# EAGLE schematic BREAKER BOARD FOR TLC5951 (EAGLE 7.7.0)
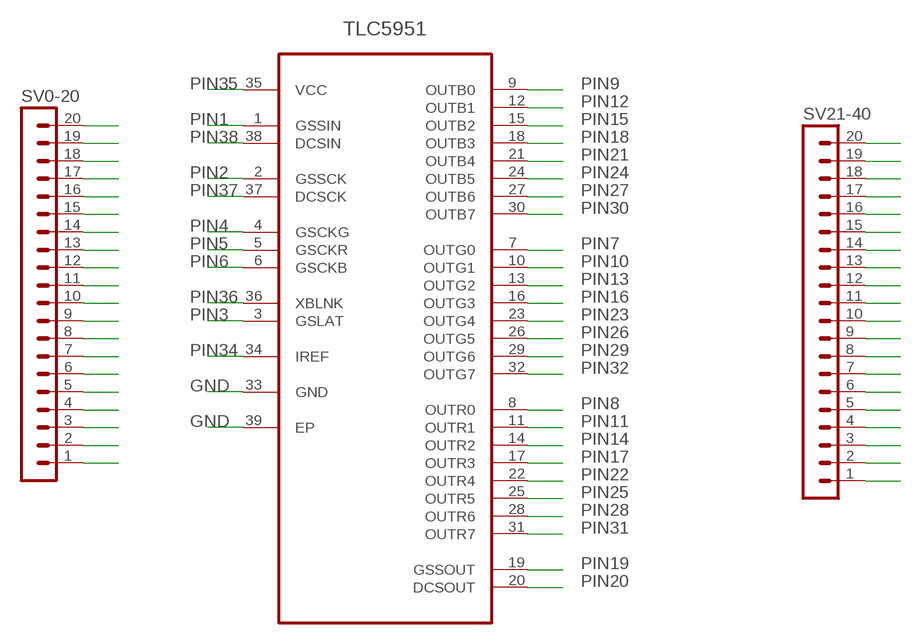
[diagram p0: schematic, sheet 1]

## Parts
SV0-20  MA20-1  [MA20-1]
SV21-40  MA20-1  [MA20-1]
TLC5951  TLC5951DAP  [SOP65P810X120-39N]

## Nets
GND: SV0-20.20 TLC5951.33(GND) TLC5951.39(EP)
PIN1: SV0-20.1 TLC5951.1(GSSIN)
PIN2: SV0-20.2 TLC5951.2(GSSCK)
PIN3: SV0-20.3 TLC5951.3(GSLAT)
PIN4: SV0-20.4 TLC5951.4(GSCKG)
PIN5: SV0-20.5 TLC5951.5(GSCKR)
PIN6: SV0-20.6 TLC5951.6(GSCKB)
PIN7: SV0-20.7 TLC5951.7(OUTG0)
PIN8: SV0-20.8 TLC5951.8(OUTR0)
PIN9: SV0-20.9 TLC5951.9(OUTB0)
PIN10: SV0-20.10 TLC5951.10(OUTG1)
PIN11: SV0-20.11 TLC5951.11(OUTR1)
PIN12: SV0-20.12 TLC5951.12(OUTB1)
PIN13: SV0-20.13 TLC5951.13(OUTG2)
PIN14: SV0-20.14 TLC5951.14(OUTR2)
PIN15: SV0-20.15 TLC5951.15(OUTB2)
PIN16: SV0-20.16 TLC5951.16(OUTG3)
PIN17: SV0-20.17 TLC5951.17(OUTR3)
PIN18: SV0-20.18 TLC5951.18(OUTB3)
PIN19: SV0-20.19 TLC5951.19(GSSOUT)
PIN20: SV21-40.19 TLC5951.20(DCSOUT)
PIN21: SV21-40.18 TLC5951.21(OUTB4)
PIN22: SV21-40.17 TLC5951.22(OUTR4)
PIN23: SV21-40.16 TLC5951.23(OUTG4)
PIN24: SV21-40.15 TLC5951.24(OUTB5)
PIN25: SV21-40.14 TLC5951.25(OUTR5)
PIN26: SV21-40.13 TLC5951.26(OUTG5)
PIN27: SV21-40.12 TLC5951.27(OUTB6)
PIN28: SV21-40.11 TLC5951.28(OUTR6)
PIN29: SV21-40.10 TLC5951.29(OUTG6)
PIN30: SV21-40.9 TLC5951.30(OUTB7)
PIN31: SV21-40.8 TLC5951.31(OUTR7)
PIN32: SV21-40.7 TLC5951.32(OUTG7)
PIN33: SV21-40.6
PIN34: SV21-40.5 TLC5951.34(IREF)
PIN35: SV21-40.4 TLC5951.35(VCC)
PIN36: SV21-40.3 TLC5951.36(XBLNK)
PIN37: SV21-40.2 TLC5951.37(DCSCK)
PIN38: SV21-40.1 TLC5951.38(DCSIN)
PIN40: SV21-40.20

## Library data of the parts
SV0-20 SV21-40 = con-lstb:MA20-1: PIN HEADER; OC_FARNELL: unknown; OC_NEWARK: unknown
TLC5951 = Texas Instruments_By_element14_Batch_1:TLC5951DAP: 12-Bit PWM LED Driver; MPN: TLC5951DAP; OC_FARNELL: -; OC_NEWARK: 09R6488; PACKAGE: HTSSOP-38; SUPPLIER: Texas Instruments